# Altium project Cade.PrjPCB
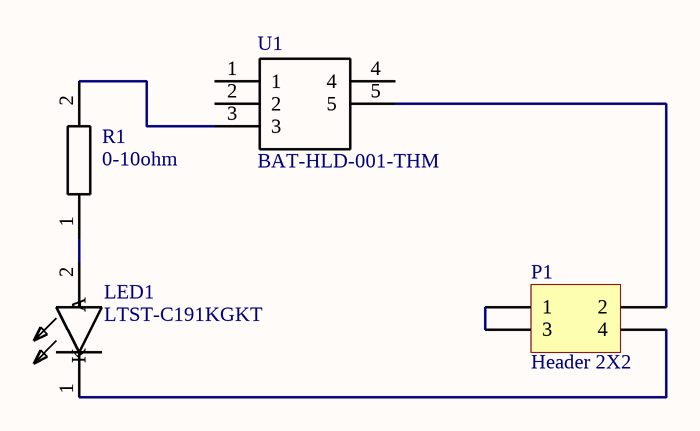
[diagram p0: Cade.SchDoc]
1 sheet, 4 parts. Net scope: global (net labels, ports and power ports of the same name join across sheets).
Board file: Cade.PcbDoc

## Sheet Cade.SchDoc
size C

### Parts
LED1  LTST-C191KGKT  [LEDC1608X55N]
P1  Header 2X2  [HDR2X2]
R1  0-10ohm  [RESC2012X60N]
U1  BAT-HLD-001-THM  [BATHLD001THM]

### Nets
NetLED1_1: LED1.1(K) P1.4
NetLED1_2: LED1.2(A) R1.1
NetP1_1: P1.1 P1.3
NetP1_2: P1.2 U1.5
NetR1_2: R1.2 U1.3

Not connected (* = marked no-connect by the designer): U1 1 2 4

### Library data of the parts
LED1 = LTST-C191KGKT: LED; Manufacturer_Name: Lite-On; Datasheet Link: http://www.mouser.com/ds/2/239/S_110_LTST-C191KGKT-369560.pdf; Height: 0.55mm; Manufacturer_Part_Number: LTST-C191KGKT; Mouser Part Number: 859-LTST-C191KGKT; Mouser Price/Stock: https://www.mouser.com/Search/Refine.aspx?Keyword=859-LTST-C191KGKT; RS Part Number: 6921010P; RS Price/Stock: http://uk.rs-online.com/web/p/products/6921010P
P1 = Header 2X2: Header, 2-Pin, Dual row; LatestRevisionDate: 17-Jul-2002; LatestRevisionNote: Re-released for DXP Platform.; Publisher: Altium Limited
R1 = CRCW0805160RFKEAHP: Resistor; Manufacturer_Name: Vishay; Datasheet Link: https://componentsearchengine.com/Datasheets/1/CRCW08051R00FKEAHP.pdf; Height: 0.6mm; Manufacturer_Part_Number: CRCW0805160RFKEAHP; Mouser Part Number: 71-CRCW0805160RFKEAH; Mouser Price/Stock: https://www.mouser.com/Search/Refine.aspx?Keyword=71-CRCW0805160RFKEAH
U1 = BAT-HLD-001-THM: Undefined or Miscellaneous; Manufacturer_Name: Linx Technologies; Datasheet Link: http://www.mouser.com/datasheet/2/238/BAT-HLD-001-THM Diagram-1175214.pdf; Height: 4.2mm; Manufacturer_Part_Number: BAT-HLD-001-THM; Mouser Part Number: 712-BAT-HLD-001-THM; Mouser Price/Stock: https://www.mouser.com/Search/Refine.aspx?Keyword=712-BAT-HLD-001-THM